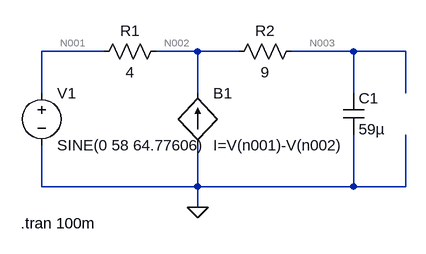
[diagram p0: schematic Q6 at2.asc]
Q6 at2.asc, the LTspice schematic file:
Version 4.1
SHEET 1 880 680
WIRE -16 80 -112 80
WIRE 128 80 64 80
WIRE 192 80 128 80
WIRE 368 80 272 80
WIRE 448 80 368 80
WIRE -112 144 -112 80
WIRE 128 144 128 80
WIRE 368 144 368 80
WIRE 448 144 448 80
WIRE -112 288 -112 224
WIRE 128 288 128 224
WIRE 128 288 -112 288
WIRE 368 288 368 208
WIRE 368 288 128 288
WIRE 448 288 448 208
WIRE 448 288 368 288
WIRE 128 320 128 288
FLAG 128 320 0
SYMBOL voltage -112 128 R0
WINDOW 123 0 0 Left 0
WINDOW 39 0 0 Left 0
SYMATTR InstName V1
SYMATTR Value SINE(0 58 64.77606)
SYMBOL res 80 64 R90
WINDOW 0 0 56 VBottom 2
WINDOW 3 32 56 VTop 2
SYMATTR InstName R1
SYMATTR Value 4
SYMBOL res 288 64 R90
WINDOW 0 0 56 VBottom 2
WINDOW 3 32 56 VTop 2
SYMATTR InstName R2
SYMATTR Value 9
SYMBOL cap 352 144 R0
SYMATTR InstName C1
SYMATTR Value 59µ
SYMBOL bi2 128 144 R0
SYMATTR InstName B1
SYMATTR Value I=V(n001)-V(n002)
TEXT -144 344 Left 2 !.tran 100m

The netlist it stands for:
* Q6 at2.asc
V1 N001 0 SINE(0 58 64.77606)
R1 N002 N001 4
R2 N003 N002 9
C1 N003 0 59µ
B1 0 N002 I=V(n001)-V(n002)
.tran 100m
.backanno
.end

* Results of the author's LTspice run, read from the files saved beside the schematic
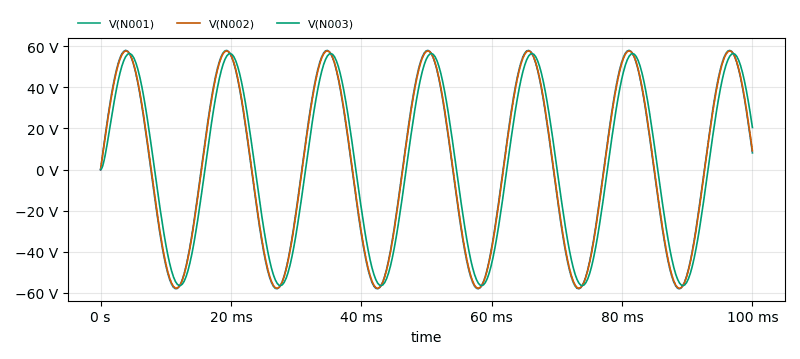
[diagram p1: Transient Analysis of Q6 at2.asc, plotted from the saved traces]
* Transient Analysis, 1 run:
*   V(N001): min -57.99 V, max 58 V, average 2.833 V, rms 41.08 V, last 8.134 V
*   V(N002): min -57.76 V, max 57.76 V, average 2.824 V, rms 40.91 V, last 9.145 V
*   V(N003): min -56.46 V, max 56.46 V, average 2.715 V, rms 39.98 V, last 20.51 V